# EAGLE schematic low_voltage_system (EAGLE 9.5.0)
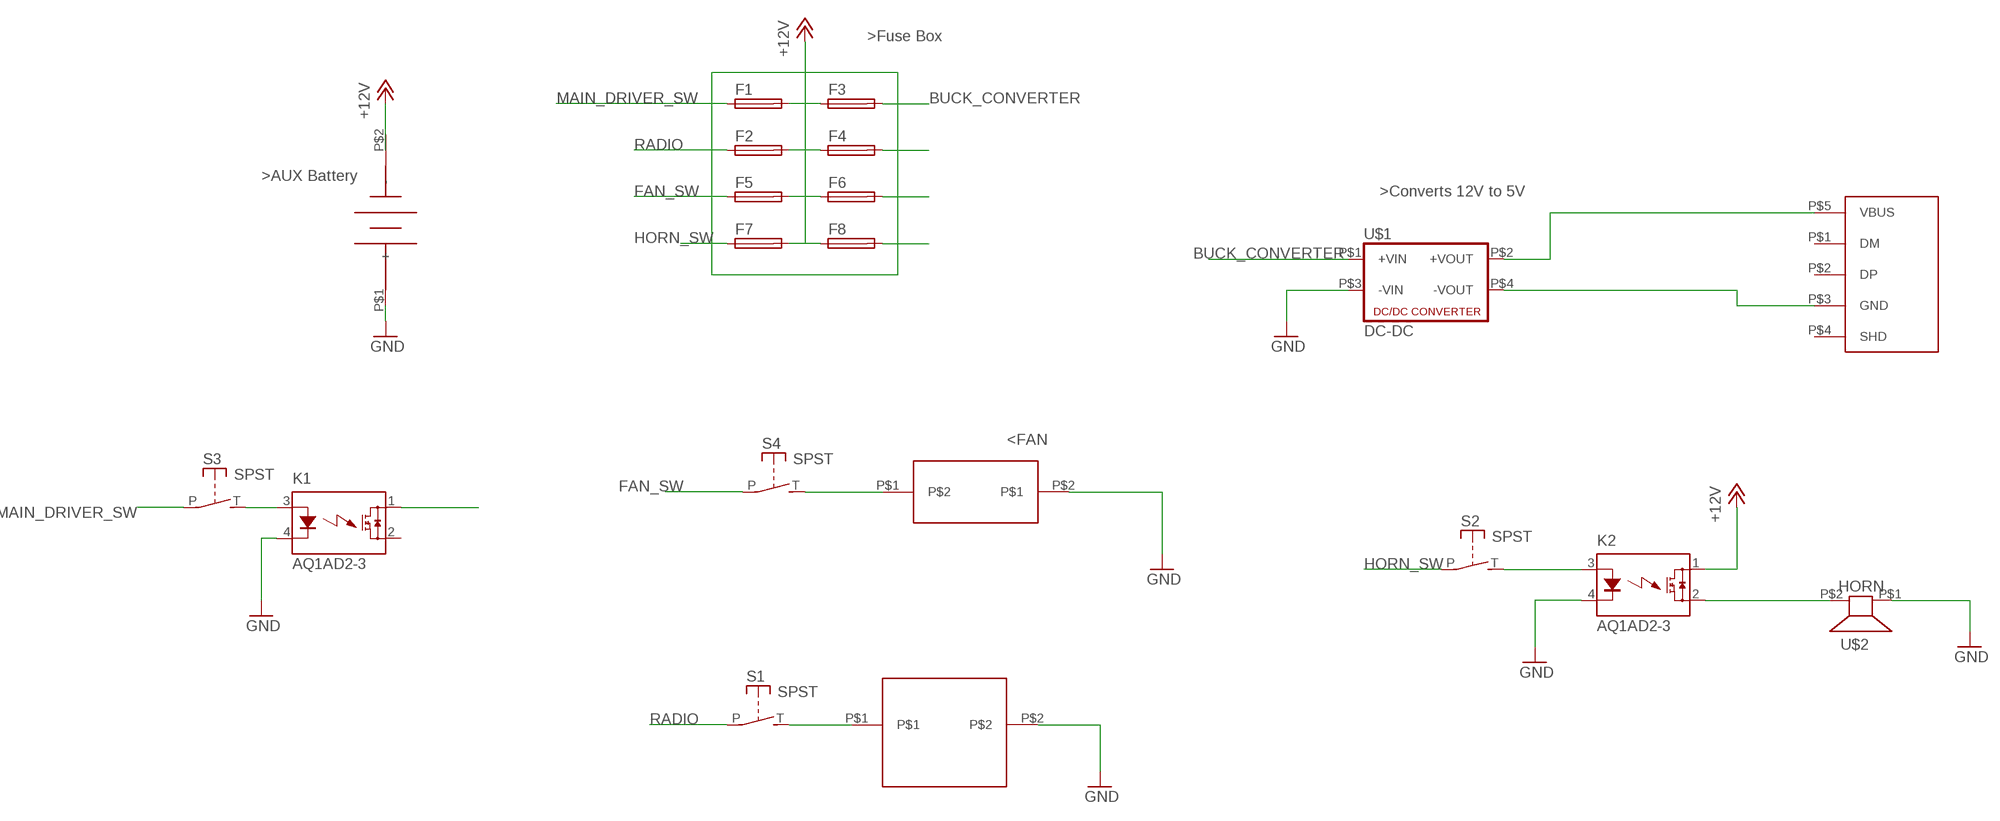
[diagram p0: schematic, sheet 1]

## Parts
F1  19559  [19559]
F2  19559  [19559]
F3  19559  [19559]
F4  19559  [19559]
F5  19559  [19559]
F6  19559  [19559]
F7  19559  [19559]
F8  19559  [19559]
K1  AQ1AD2-3  [AQ1]
K2  AQ1AD2-3  [AQ1]
S1  SPST  [JUDCOSPST]
S2  SPST  [JUDCOSPST]
S3  SPST  [JUDCOSPST]
S4  SPST  [JUDCOSPST]
U$1  DC-DC  [DC-DC]
U$2  HORN  [HORN]
U$3  12V-BATTERY  [12V-BATTERY]
U$4  USB_CHARGER  [USB_CHARGER]
U$5  RADIO  [RADIO]
U$6  DRIVER_FAN  [DRIVER_FAN]

## Nets
+12V: K2.1(DS1) U$3.P$2(-)
BUCK_CONVERTER: F3.2 U$1.P$1(+VIN)
FAN_SW: F5.1 S4.P
GND: K1.4(K) K2.4(K) U$1.P$3(-VIN) U$2.P$1 U$3.P$1(+) U$5.P$2 U$6.P$2
HORN_SW: F7.1 S2.P
MAIN_DRIVER_SW: F1.1 S3.P
N$2: F1.2 F3.1
N$3: F2.2 F4.1
N$4: F5.2 F6.1
N$5: F7.2 F8.1
N$6: K1.3(A) S3.T(S)
N$7: K1.1(DS1)
N$8: U$1.P$2(+VOUT) U$4.P$5(VBUS)
N$9: U$1.P$4(-VOUT) U$4.P$3(GND)
N$10: S1.T(S) U$5.P$1
N$11: F4.2
N$12: F6.2
N$13: F8.2
N$14: K2.3(A) S2.T(S)
N$15: K2.2(DS2) U$2.P$2
N$16: S4.T(S) U$6.P$1
RADIO: F2.1 S1.P
Unconnected: K1.2(DS2) U$4.P$1(DM) U$4.P$2(DP) U$4.P$4(SHD)

## Notes on the sheet
- >Fuse Box
- >AUX Battery
- >Converts 12V to 5V

## Library data of the parts
F1-F8 = fuse:19559: FUSE HOLDER TR5, Wickmann; MPN: 55900000001; OC_FARNELL: 9516360; OC_NEWARK: 02P0286
K1 K2 = relay:AQ*: SOLID STATE RELAY NAiS Source: http://www.mew-europe.com/.. en_ds_61601_0000.pdf; MF: AROMAT/ MATSUSHITA; MPN: AQ1AD2-3/28VDC; OC_FARNELL: unknown; OC_NEWARK: 10C4052
S1-S4 = adafruit:SPST: Judco 50-0015-00
U$1 = Auxilary:DC-DC: A DC To DC Stepdown Converter
U$2 = Auxilary:HORN: Car Horn
U$3 = Auxilary:12V-BATTERY: 12V Lead Acid Battery Used To Power Aux Components
U$4 = Auxilary:USB_CHARGER: USB CHARGER
U$5 = Auxilary:RADIO
U$6 = Auxilary:DRIVER_FAN